# EAGLE design T04_Main_Board (EAGLE 6.3)
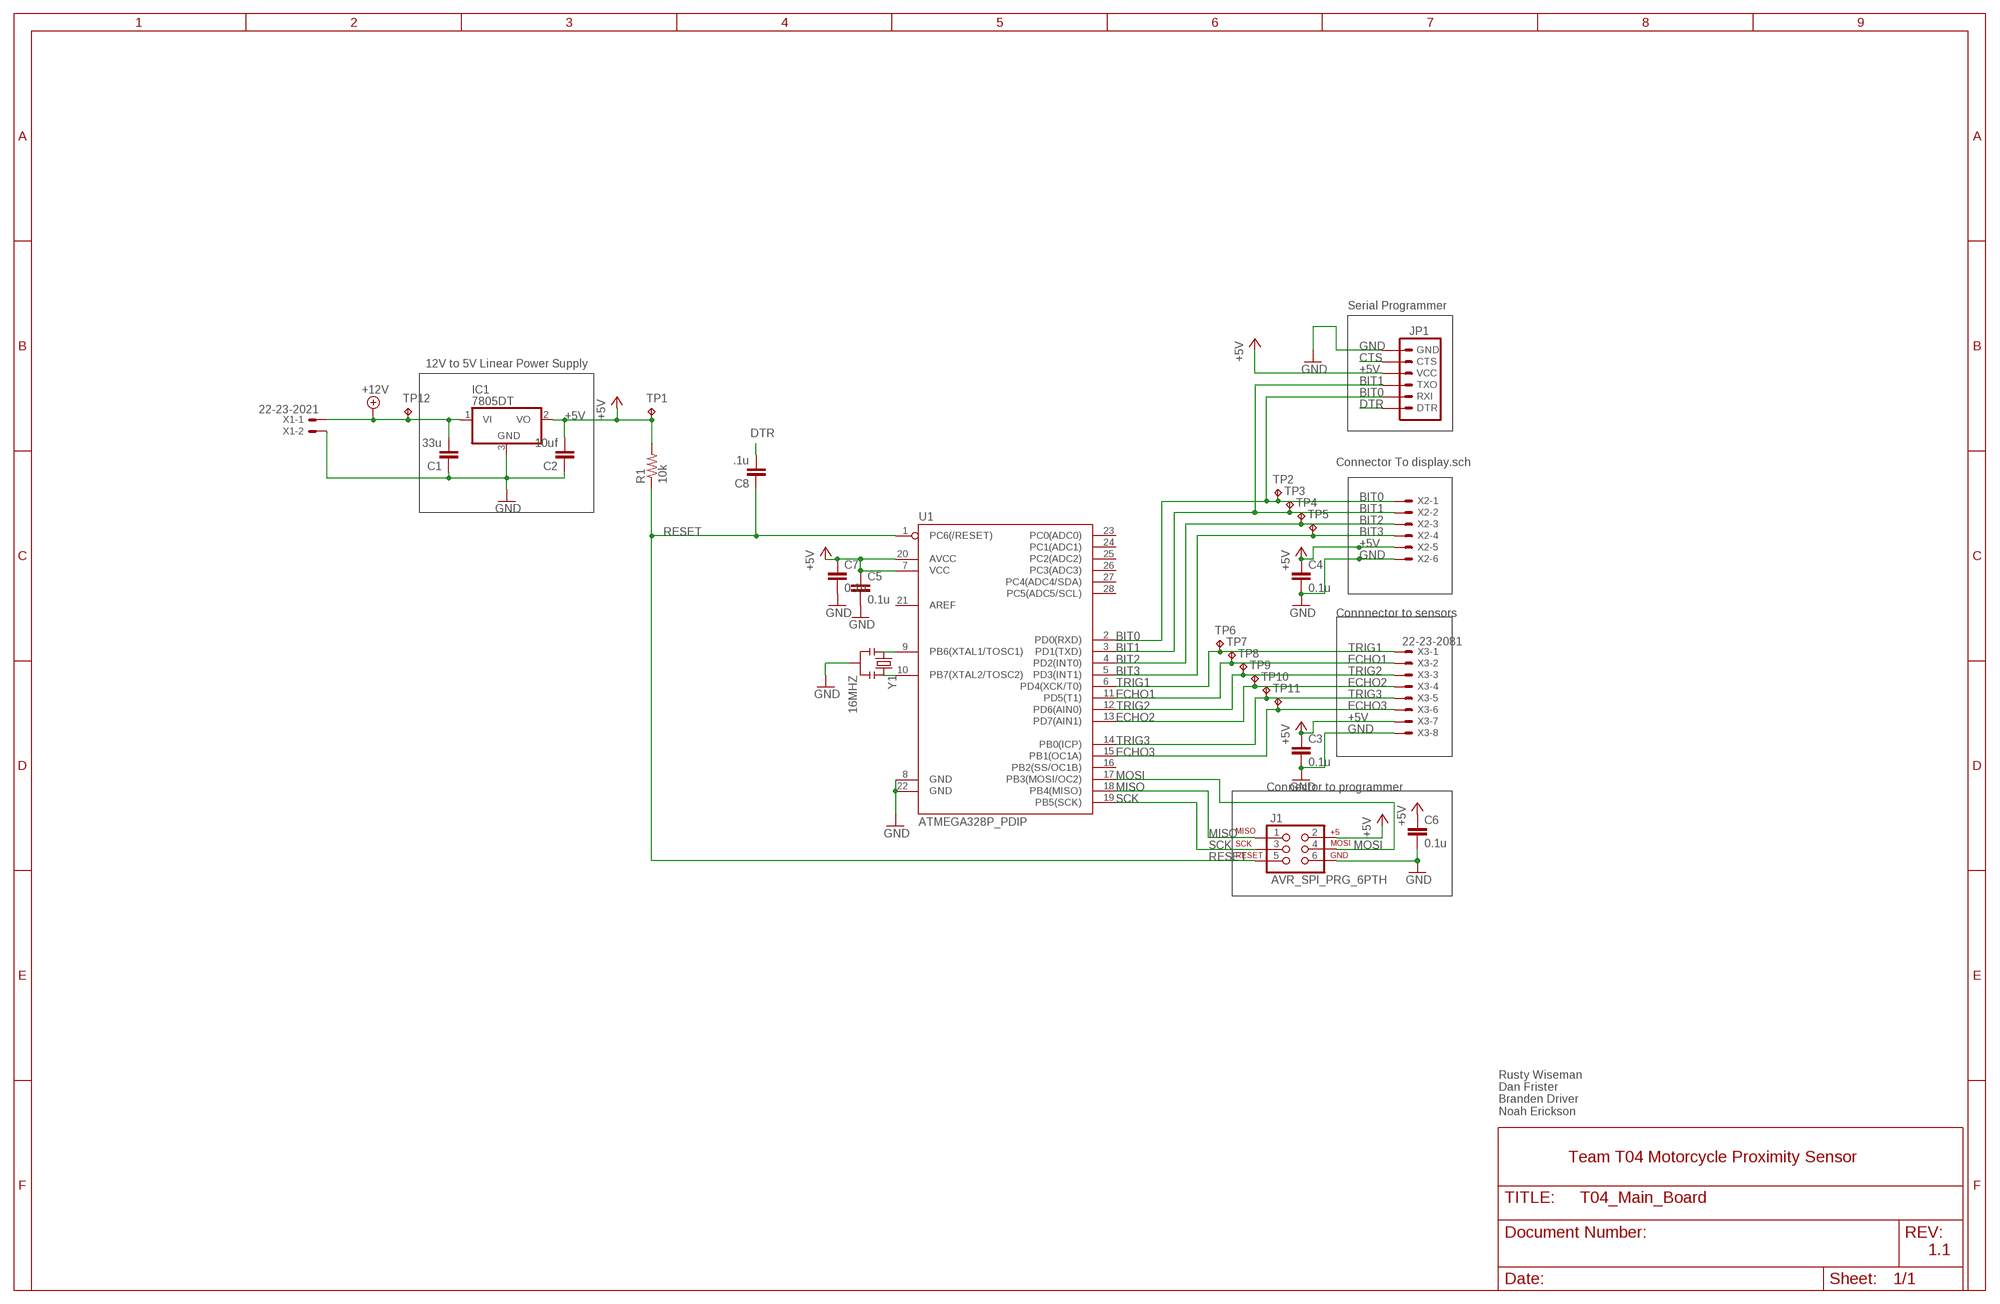
[diagram p0: schematic, sheet 1]

## Parts
C1  33u  C-EU025-024X044  [C025-024X044]
C2  10uf  C-EU025-024X044  [C025-024X044]
C3  0.1u  C-EU025-024X044  [C025-024X044]
C4  0.1u  C-EU025-024X044  [C025-024X044]
C5  0.1u  C-EU025-024X044  [C025-024X044]
C6  0.1u  C-EU025-024X044  [C025-024X044]
C7  0.1u  C-EU025-024X044  [C025-024X044]
C8  .1u  C-EU025-024X044  [C025-024X044]
IC1  7805DT  [TO252]
J1  AVR_SPI_PRG_6PTH  [2X3]
JP1  ARDUINO_SERIAL_PROGRAMSMD  [1X06-SMD]
R1  10k  R-US_M2309  [M2309]
TP1  TPB1,27  [B1,27]
TP2  TPB1,27  [B1,27]
TP3  TPB1,27  [B1,27]
TP4  TPB1,27  [B1,27]
TP5  TPB1,27  [B1,27]
TP6  TPB1,27  [B1,27]
TP7  TPB1,27  [B1,27]
TP8  TPB1,27  [B1,27]
TP9  TPB1,27  [B1,27]
TP10  TPB1,27  [B1,27]
TP11  TPB1,27  [B1,27]
TP12  TPB1,27  [B1,27]
U1  ATMEGA328P_PDIP  [DIL28-3]
X1  22-23-2021  [22-23-2021]
X2  22-23-2061  [22-23-2061]
X3  22-23-2081  [22-23-2081]
Y1  16MHZ  RESONATOR16MHZ  [RESONATOR-SMD]

## Nets
+5V: C2.2 C3.1 C4.1 C5.1 C6.1 C7.1 IC1.2(VO) J1.2 JP1.4(VCC) R1.2 TP1.TP U1.7(VCC) U1.20(AVCC) X2.5 X3.7
+12V: C1.2 IC1.1(VI) TP12.TP X1.1
BIT0: JP1.2(RXI) TP2.TP U1.2(PD0(RXD)) X2.1
BIT1: JP1.3(TXO) TP3.TP U1.3(PD1(TXD)) X2.2
BIT2: TP4.TP U1.4(PD2(INT0)) X2.3
BIT3: TP5.TP U1.5(PD3(INT1)) X2.4
CTS: JP1.5(CTS)
DTR: C8.2 JP1.1(DTR)
ECHO1: TP7.TP U1.11(PD5(T1)) X3.2
ECHO2: TP9.TP U1.13(PD7(AIN1)) X3.4
ECHO3: TP11.TP U1.15(PB1(OC1A)) X3.6
GND: C1.1 C2.1 C3.2 C4.2 C5.2 C6.2 C7.2 IC1.3(GND) J1.6 JP1.6(GND) U1.8(GND) U1.22(GND) X1.2 X2.6 X3.8 Y1.2
MISO: J1.1 U1.18(PB4(MISO))
MOSI: J1.4 U1.17(PB3(MOSI/OC2))
N$1: U1.9(PB6(XTAL1/TOSC1)) Y1.1
N$2: U1.10(PB7(XTAL2/TOSC2)) Y1.3
RESET: C8.1 J1.5 R1.1 U1.1(PC6(/RESET))
SCK: J1.3 U1.19(PB5(SCK))
TRIG1: TP6.TP U1.6(PD4(XCK/T0)) X3.1
TRIG2: TP8.TP U1.12(PD6(AIN0)) X3.3
TRIG3: TP10.TP U1.14(PB0(ICP)) X3.5
Unconnected: U1.16(PB2(SS/OC1B)) U1.21(AREF) U1.23(PC0(ADC0)) U1.24(PC1(ADC1)) U1.25(PC2(ADC2)) U1.26(PC3(ADC3)) U1.27(PC4(ADC4/SDA)) U1.28(PC5(ADC5/SCL))

## Notes on the sheet
- Serial Programmer
- 12V to 5V Linear Power Supply
- Connector To display.sch
- Connnector to sensors
- Connector to programmer
- Rusty Wiseman
  Dan Frister
  Branden Driver
  Noah Erickson
- Team T04 Motorcycle Proximity Sensor
- 1.1

## Library data of the parts
C1-C8 = rcl:C-EU: CAPACITOR, European symbol
IC1 = linear:78*: Positive VOLTAGE REGULATOR Source: http://cache.national.com/ds/LM/LM78L05.pdf http://www.fairchildsemi.com/ds/LM/LM7805.pdf
J1 = SparkFun-Connectors:AVR_SPI_PRG_6: AVR ISP 6 Pin This is the reduced ISP connector for AVR programming. Common on Arduino. This footprint will take up less PCB space and can be used with a 10-pin to 6-pin adapter such as SKU: BOB-08508 **Special note about "TEST_POINT" package. The stop mask is on the top side, so if you want your programming test points to be on the bottom of your board, make sure to place this package on the bottom side of the board. This also ensure that the orientation to program from the bottom side will be correct.
JP1 = SparkFun-Connectors:ARDUINO_SERIAL_PROGRAM: FTDI connector footprints
R1 = rcl:R-US_: RESISTOR, American symbol
TP1-TP12 = testpad:TP: Test pad
U1 = SparkFun-DigitalIC:ATMEGA328P_PDIP: uC used in the Arduino 32kb flash, 1k EEPROM, 2k SRAM This is the through-hole version of this chip.
X1 = con-molex:22-23-2021: .100" (2.54mm) Center Header - 2 Pin; MF: MOLEX; MPN: 22-23-2021; OC_FARNELL: 1462926; OC_NEWARK: 25C3832
X2 = con-molex:22-23-2061: .100" (2.54mm) Center Header - 6 Pin; MF: MOLEX; MPN: 22-23-2061; OC_FARNELL: 1462922; OC_NEWARK: 27C1933
X3 = con-molex:22-23-2081: .100" (2.54mm) Center Header - 8 Pin; MF: MOLEX; MPN: 22-23-2081; OC_FARNELL: 1756826; OC_NEWARK: 01C7592
Y1 = SparkFun-FreqCtrl:RESONATOR: Resonator Small SMD resonator. Used, eg, on the Arduino Pro/ Pro Mini boards. 8MHz- XTAL-08895 16MHz- XTAL-08900; PROD_ID: XTAL-08900

## Board
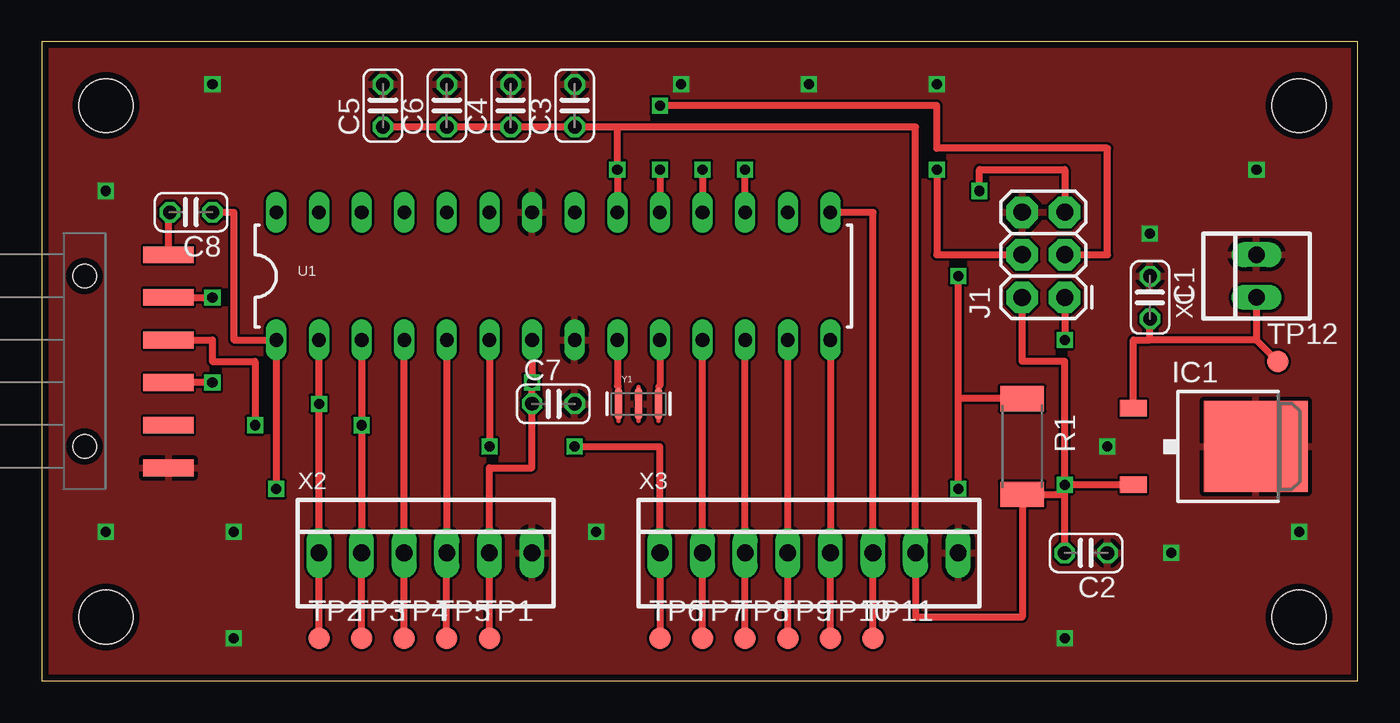
[diagram p1: board, top side]
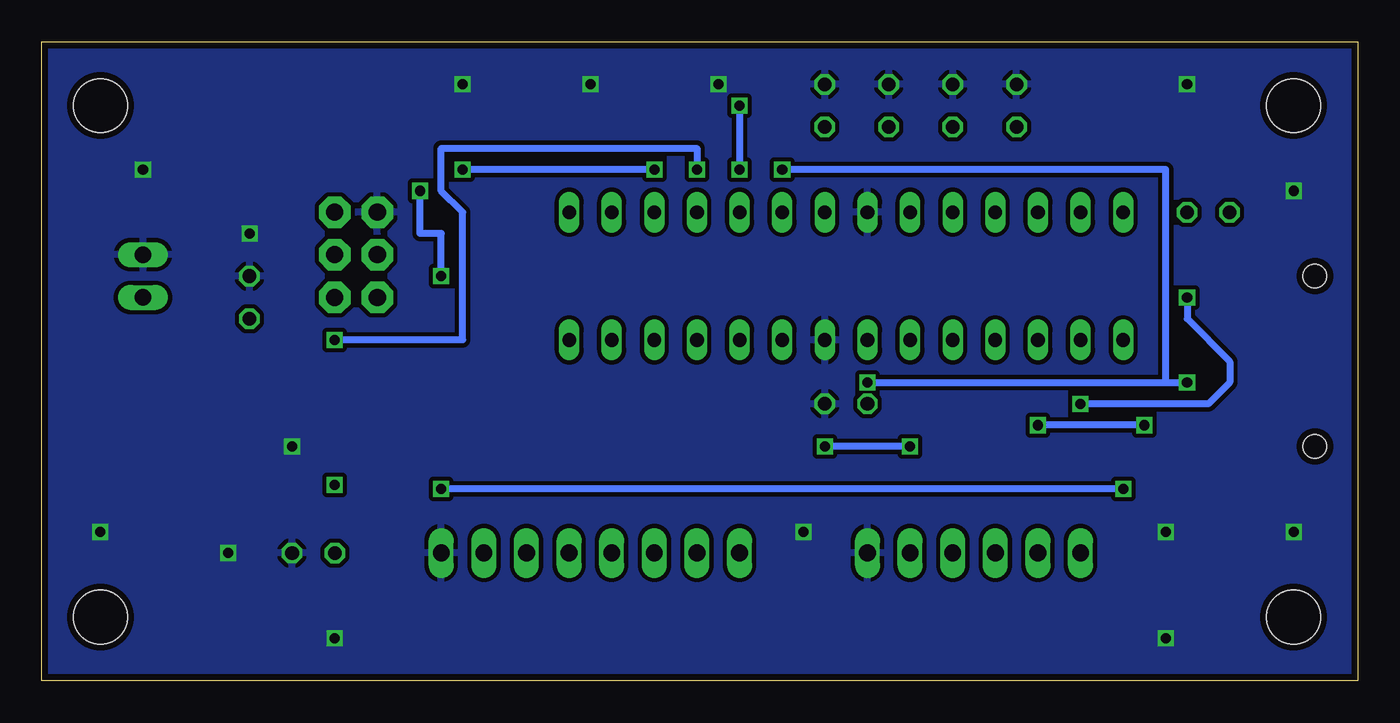
[diagram p2: board, bottom side, seen from below]

Size 78.41 x 38.09 mm. Coordinates in mm from the lower left corner, seen from the top.
Outline: 0,0 78.41,0 78.41,38.09 0,38.09 0,0
Copper layers (1*16): Top 0.0356mm / dielectric 1.5011mm / Bottom 0.0356mm
Design rules "OSH-Park-2-layer": minimum track width 6mil, minimum drill 13mil, track to track 6mil, track to pad 6mil, pad to pad 6mil, via to via 6mil, smd to smd 6mil, copper to edge 15mil, drill to drill 6mil, minimum pad ring 7mil, minimum via ring 7mil, stop-mask expansion 3mil, vias tented up to drill 0mil, thermal gap 10mil
Holes 3.2 mm at 3.81,3.81 74.93,3.81 74.93,34.29 3.81,34.29

### Footprints (pad centres in the part's own frame; a part is rotated, then mirrored left to right if it is on the bottom)
C025-024X044 = drill 0.813 octagon: 1 -1.27,0; 2 1.27,0
TO252 = smd 1 x 1.6: 1 -2.28,-4.8; 2 2.28,-4.8 | smd 5.4 x 6.2: 3 0,2.5
2X3 = drill 1.016 pad 1.88 octagon: 1 0,0; 2 0,2.54; 3 2.54,0; 4 2.54,2.54; 5 5.08,0; 6 5.08,2.54
1X06-SMD = smd 1 x 3: 1 -6.35,5; 2 -3.81,5; 3 -1.27,5; 4 1.27,5; 5 3.81,5; 6 6.35,5 | hole 1.4: -5.08,0; 5.08,0
M2309 = smd 1.5 x 2.6: 1 -2.85,0; 2 2.85,0
B1,27 = smd 1.27 x 1.27: TP 0,0
DIL28-3 = drill 0.813 long: 1 -16.51,-3.81; 2 -13.97,-3.81; 3 -11.43,-3.81; 4 -8.89,-3.81; 5 -6.35,-3.81; 6 -3.81,-3.81; 7 -1.27,-3.81; 8 1.27,-3.81; 9 3.81,-3.81; 10 6.35,-3.81; 11 8.89,-3.81; 12 11.43,-3.81; 13 13.97,-3.81; 14 16.51,-3.81; 15 16.51,3.81; 16 13.97,3.81; 17 11.43,3.81; 18 8.89,3.81; 19 6.35,3.81; 20 3.81,3.81; 21 1.27,3.81; 22 -1.27,3.81; 23 -3.81,3.81; 24 -6.35,3.81; 25 -8.89,3.81; 26 -11.43,3.81; 27 -13.97,3.81; 28 -16.51,3.81
22-23-2021 = drill 1 long: 1 -1.27,0; 2 1.27,0
22-23-2061 = drill 1 long: 1 -6.35,0; 2 -3.81,0; 3 -1.27,0; 4 1.27,0; 5 3.81,0; 6 6.35,0
22-23-2081 = drill 1 long: 1 -8.89,0; 2 -6.35,0; 3 -3.81,0; 4 -1.27,0; 5 1.27,0; 6 3.81,0; 7 6.35,0; 8 8.89,0
RESONATOR-SMD = smd 0.45 x 1.905: 1 -1.2,0; 2 0,0; 3 1.2,0

### Placement (x,y rotation side)
C1  66.04,22.86 270 top
C2  62.23,7.62 180 top
C3  31.75,34.29 90 top
C4  27.94,34.29 90 top
C5  20.32,34.29 90 top
C6  24.13,34.29 90 top
C7  30.48,16.51 0 top
C8  8.89,27.94 180 top
IC1  69.85,13.97 270 top
J1  60.96,22.86 90 top
JP1  2.54,19.05 270 top
R1  58.42,13.97 270 top
TP1  26.67,2.54 0 top
TP2  16.51,2.54 0 top
TP3  19.05,2.54 0 top
TP4  21.59,2.54 0 top
TP5  24.13,2.54 0 top
TP6  36.83,2.54 0 top
TP7  39.37,2.54 0 top
TP8  41.91,2.54 0 top
TP9  44.45,2.54 0 top
TP10  46.99,2.54 0 top
TP11  49.53,2.54 0 top
TP12  73.66,19.05 0 top
U1  30.48,24.13 0 top
X1  72.39,24.13 90 top
X2  22.86,7.62 0 top
X3  45.72,7.62 0 top
Y1  35.56,16.51 0 top

### Tracks (layer width: path | path; a pad name or v marks a point on that pad's centre or on a via)
+5V  (via drill 0.6)
  Top 0.406: 60.96,11.12 R1.2 58.42,3.81 52.07,3.81 X3.7 52.07,33.02 34.29,33.02 | 60.96,11.12 v60.96,11.69 | IC1.2 v60.96,11.69 | TP1.TP X2.5 26.67,12.7 29.21,12.7 C7.1 v29.21,17.78 U1.7 | 34.29,33.02 v34.29,30.48 U1.20 | 34.29,33.02 C3.1 C4.1 C6.1 C5.1 | C2.2 60.96,11.12 | v10.16,17.78 JP1.4 | v60.96,11.69 60.96,19.05 58.42,19.05 J1.2
  Bottom 0.406: v34.29,30.48 11.43,30.48 11.43,17.78 v10.16,17.78 v29.21,17.78
+12V
  Top 0.406: 64.77,16.25 IC1.1 65.05,20.32 66.04,20.32 | 72.39,20.32 TP12.TP | X1.1 72.39,20.32 | 72.39,20.32 66.04,20.32 | 66.04,20.32 C1.2
BIT0  (via drill 0.6)
  Top 0.406: TP2.TP X2.1 v16.51,16.51 U1.2 | JP1.2 v10.16,22.86
  Bottom 0.406: v10.16,22.86 10.16,21.59 7.62,19.05 7.62,17.78 8.89,16.51 v16.51,16.51
BIT1  (via drill 0.6)
  Top 0.406: TP3.TP X2.2 v19.05,15.24 U1.3 | JP1.3 10.16,20.32 10.16,19.05 12.7,19.05 v12.7,15.24
  Bottom 0.406: v12.7,15.24 v19.05,15.24
BIT2
  Top 0.406: TP4.TP X2.3 U1.4
BIT3
  Top 0.406: TP5.TP X2.4 U1.5
DTR
  Top 0.406: JP1.1 7.54,27.86 C8.2
ECHO1
  Top 0.406: TP7.TP X3.2 U1.11
ECHO2
  Top 0.406: U1.13 X3.4 TP9.TP
ECHO3
  Top 0.406: U1.15 49.53,27.94 X3.6 TP11.TP
GND  (via drill 0.6)
  other vias: 3.81,8.89 11.43,8.89 11.43,2.54 33.02,8.89 67.31,7.62 74.93,8.89 60.96,2.54 66.04,26.67 72.39,30.48 53.34,35.56 45.72,35.56 38.1,35.56 10.16,35.56 3.81,29.21 63.5,13.97
  pour Top: 0,0 100.33,0 100.33,80.01 0,80.01
  pour Bottom (isolate 0.254): 0,0 100.33,0 100.33,80.01 0,80.01
MISO  (via drill 0.6)
  Top 0.406: v39.37,30.48 U1.18 | J1.1 v60.96,20.32
  Bottom 0.406: v39.37,30.48 39.37,31.75 54.61,31.75 54.61,29.21 53.34,27.94 53.34,20.32 v60.96,20.32
MOSI  (via drill 0.6)
  Top 0.406: U1.17 v41.91,30.48 | v53.34,30.48 53.34,25.4 J1.4
  Bottom 0.406: v41.91,30.48 v53.34,30.48
N$1
  Top 0.406: U1.9 34.29,17.6 34.36,17.53
N$2
  Top 0.406: U1.10 36.83,17.6 36.76,17.53
RESET  (via drill 0.6)
  Top 0.406: C8.1 11.43,27.94 11.43,20.32 U1.1 v13.97,11.43 | R1.1 54.61,16.82 | 54.61,16.82 v54.61,24.13 | J1.5 60.96,30.48 55.88,30.48 v55.88,29.21 | v54.61,11.43 54.61,16.82
  Bottom 0.406: v54.61,24.13 54.61,26.67 55.88,26.67 v55.88,29.21 | v13.97,11.43 v54.61,11.43
SCK  (via drill 0.6)
  Top 0.406: J1.3 63.5,25.4 63.5,31.75 53.34,31.75 53.34,34.29 v36.83,34.29 | v36.83,30.48 U1.19
  Bottom 0.406: v36.83,34.29 v36.83,30.48
TRIG1  (via drill 0.6)
  Top 0.406: U1.6 v26.67,13.97 | v31.75,13.97 36.83,13.97 X3.1 TP6.TP
  Bottom 0.406: v26.67,13.97 v31.75,13.97
TRIG2
  Top 0.406: U1.12 X3.3 TP8.TP
TRIG3
  Top 0.406: U1.14 X3.5 TP10.TP

### Text on the board
tValues: T04 Rev 1.0 / B. Driver N.Erickson / D. Frister R.Wiseman